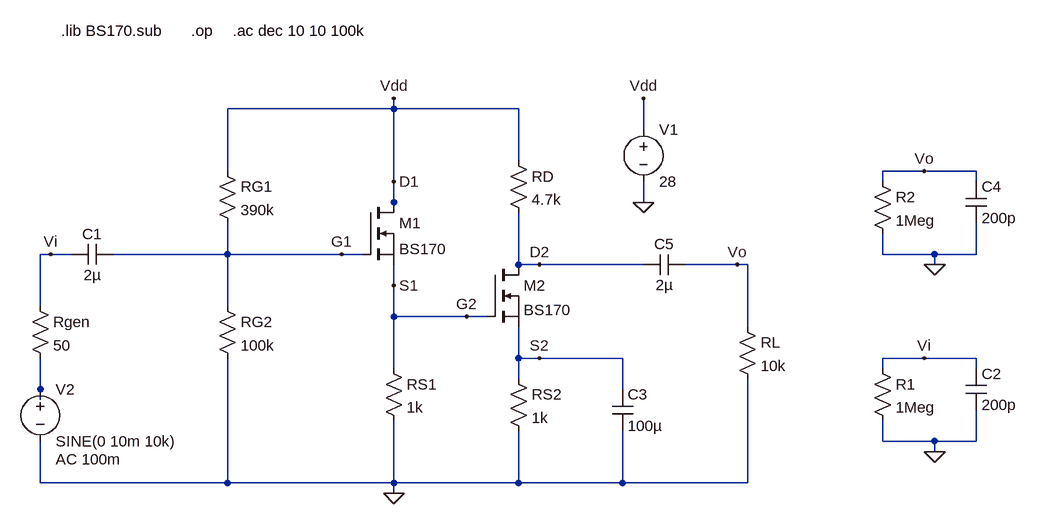
[diagram p0: schematic B_acoplado_Av_Ri.asc]
B_acoplado_Av_Ri.asc, the LTspice schematic file:
Version 4
SHEET 1 2572 856
WIRE 1008 112 1008 96
WIRE 1008 112 752 112
WIRE 1200 112 1008 112
WIRE 1392 144 1392 96
WIRE 1200 192 1200 112
WIRE 752 208 752 112
WIRE 1824 208 1760 208
WIRE 1904 208 1824 208
WIRE 1008 224 1008 112
WIRE 1760 224 1760 208
WIRE 1904 224 1904 208
WIRE 1008 256 1008 224
WIRE 1392 256 1392 224
WIRE 1008 272 1008 256
WIRE 480 336 464 336
WIRE 512 336 480 336
WIRE 752 336 752 288
WIRE 752 336 576 336
WIRE 928 336 752 336
WIRE 960 336 928 336
WIRE 1760 336 1760 304
WIRE 1840 336 1760 336
WIRE 1904 336 1904 288
WIRE 1904 336 1840 336
WIRE 1200 352 1200 272
WIRE 1232 352 1200 352
WIRE 1392 352 1232 352
WIRE 1536 352 1456 352
WIRE 1552 352 1536 352
WIRE 1840 352 1840 336
WIRE 1008 384 1008 352
WIRE 464 416 464 336
WIRE 752 416 752 336
WIRE 1008 432 1008 384
WIRE 1120 432 1008 432
WIRE 1152 432 1120 432
WIRE 1552 448 1552 352
WIRE 1200 496 1200 448
WIRE 1232 496 1200 496
WIRE 1360 496 1232 496
WIRE 1824 496 1760 496
WIRE 1904 496 1824 496
WIRE 1008 512 1008 432
WIRE 1760 512 1760 496
WIRE 1904 512 1904 496
WIRE 1200 528 1200 496
WIRE 464 544 464 496
WIRE 1360 544 1360 496
WIRE 464 560 464 544
WIRE 1760 624 1760 592
WIRE 1840 624 1760 624
WIRE 1904 624 1904 576
WIRE 1904 624 1840 624
WIRE 1840 640 1840 624
WIRE 464 688 464 624
WIRE 752 688 752 496
WIRE 752 688 464 688
WIRE 1008 688 1008 592
WIRE 1008 688 752 688
WIRE 1200 688 1200 608
WIRE 1200 688 1008 688
WIRE 1360 688 1360 608
WIRE 1360 688 1200 688
WIRE 1552 688 1552 528
WIRE 1552 688 1360 688
WIRE 1008 704 1008 688
FLAG 1008 96 Vdd
FLAG 1392 256 0
FLAG 1392 96 Vdd
FLAG 1008 704 0
FLAG 480 336 Vi
FLAG 1536 352 Vo
FLAG 1120 432 G2
FLAG 1232 352 D2
FLAG 1232 496 S2
FLAG 928 336 G1
FLAG 1008 224 D1
FLAG 1008 384 S1
FLAG 1840 640 0
FLAG 1840 352 0
FLAG 1824 208 Vo
FLAG 1824 496 Vi
SYMBOL voltage 1392 128 R0
WINDOW 123 0 0 Left 2
WINDOW 39 0 0 Left 2
SYMATTR InstName V1
SYMATTR Value 28
SYMBOL cap 576 320 R90
WINDOW 0 0 32 VBottom 2
WINDOW 3 32 32 VTop 2
SYMATTR InstName C1
SYMATTR Value 2µ
SYMBOL res 448 400 R0
SYMATTR InstName Rgen
SYMATTR Value 50
SYMBOL voltage 464 528 R0
WINDOW 39 0 0 Left 2
WINDOW 123 24 124 Left 2
SYMATTR Value2 AC 100m
SYMATTR InstName V2
SYMATTR Value SINE(0 10m 10k)
SYMBOL nmos 960 256 R0
SYMATTR InstName M1
SYMATTR Value BS170
SYMBOL res 992 496 R0
SYMATTR InstName RS1
SYMATTR Value 1k
SYMBOL res 736 400 R0
SYMATTR InstName RG2
SYMATTR Value 100k
SYMBOL res 736 192 R0
SYMATTR InstName RG1
SYMATTR Value 390k
SYMBOL res 1184 176 R0
SYMATTR InstName RD
SYMATTR Value 4.7k
SYMBOL res 1184 512 R0
SYMATTR InstName RS2
SYMATTR Value 1k
SYMBOL cap 1344 544 R0
SYMATTR InstName C3
SYMATTR Value 100µ
SYMBOL cap 1456 336 R90
WINDOW 0 0 32 VBottom 2
WINDOW 3 32 32 VTop 2
SYMATTR InstName C5
SYMATTR Value 2µ
SYMBOL res 1536 432 R0
SYMATTR InstName RL
SYMATTR Value 10k
SYMBOL nmos 1152 352 R0
WINDOW 3 56 70 Left 2
SYMATTR Value BS170
SYMATTR InstName M2
SYMBOL res 1744 496 R0
SYMATTR InstName R1
SYMATTR Value 1Meg
SYMBOL cap 1888 512 R0
SYMATTR InstName C2
SYMATTR Value 200p
SYMBOL res 1744 208 R0
SYMATTR InstName R2
SYMATTR Value 1Meg
SYMBOL cap 1888 224 R0
SYMATTR InstName C4
SYMATTR Value 200p
TEXT 496 -8 Left 2 !.lib BS170.sub
TEXT 760 -8 Left 2 !.ac dec 10 10 100k
TEXT 696 -8 Left 2 !.op

The netlist it stands for:
* B_acoplado_Av_Ri.asc
V1 D1 0 28
C1 G1 Vi 2µ
Rgen Vi N001 50
V2 N001 0 SINE(0 10m 10k) AC 100m
M1 D1 G1 S1 S1 BS170
RS1 S1 0 1k
RG2 G1 0 100k
RG1 D1 G1 390k
RD D1 D2 4.7k
RS2 S2 0 1k
C3 S2 0 100µ
C5 Vo D2 2µ
RL Vo 0 10k
M2 D2 S1 S2 S2 BS170
R1 Vi 0 1Meg
C2 Vi 0 200p
R2 Vo 0 1Meg
C4 Vo 0 200p
.model NMOS NMOS
.model PMOS PMOS
.lib standard.mos
.lib BS170.sub
.ac dec 10 10 100k
.op
.backanno
.end